# EAGLE schematic Eagle_schematic_v1 (EAGLE 7.5.0)
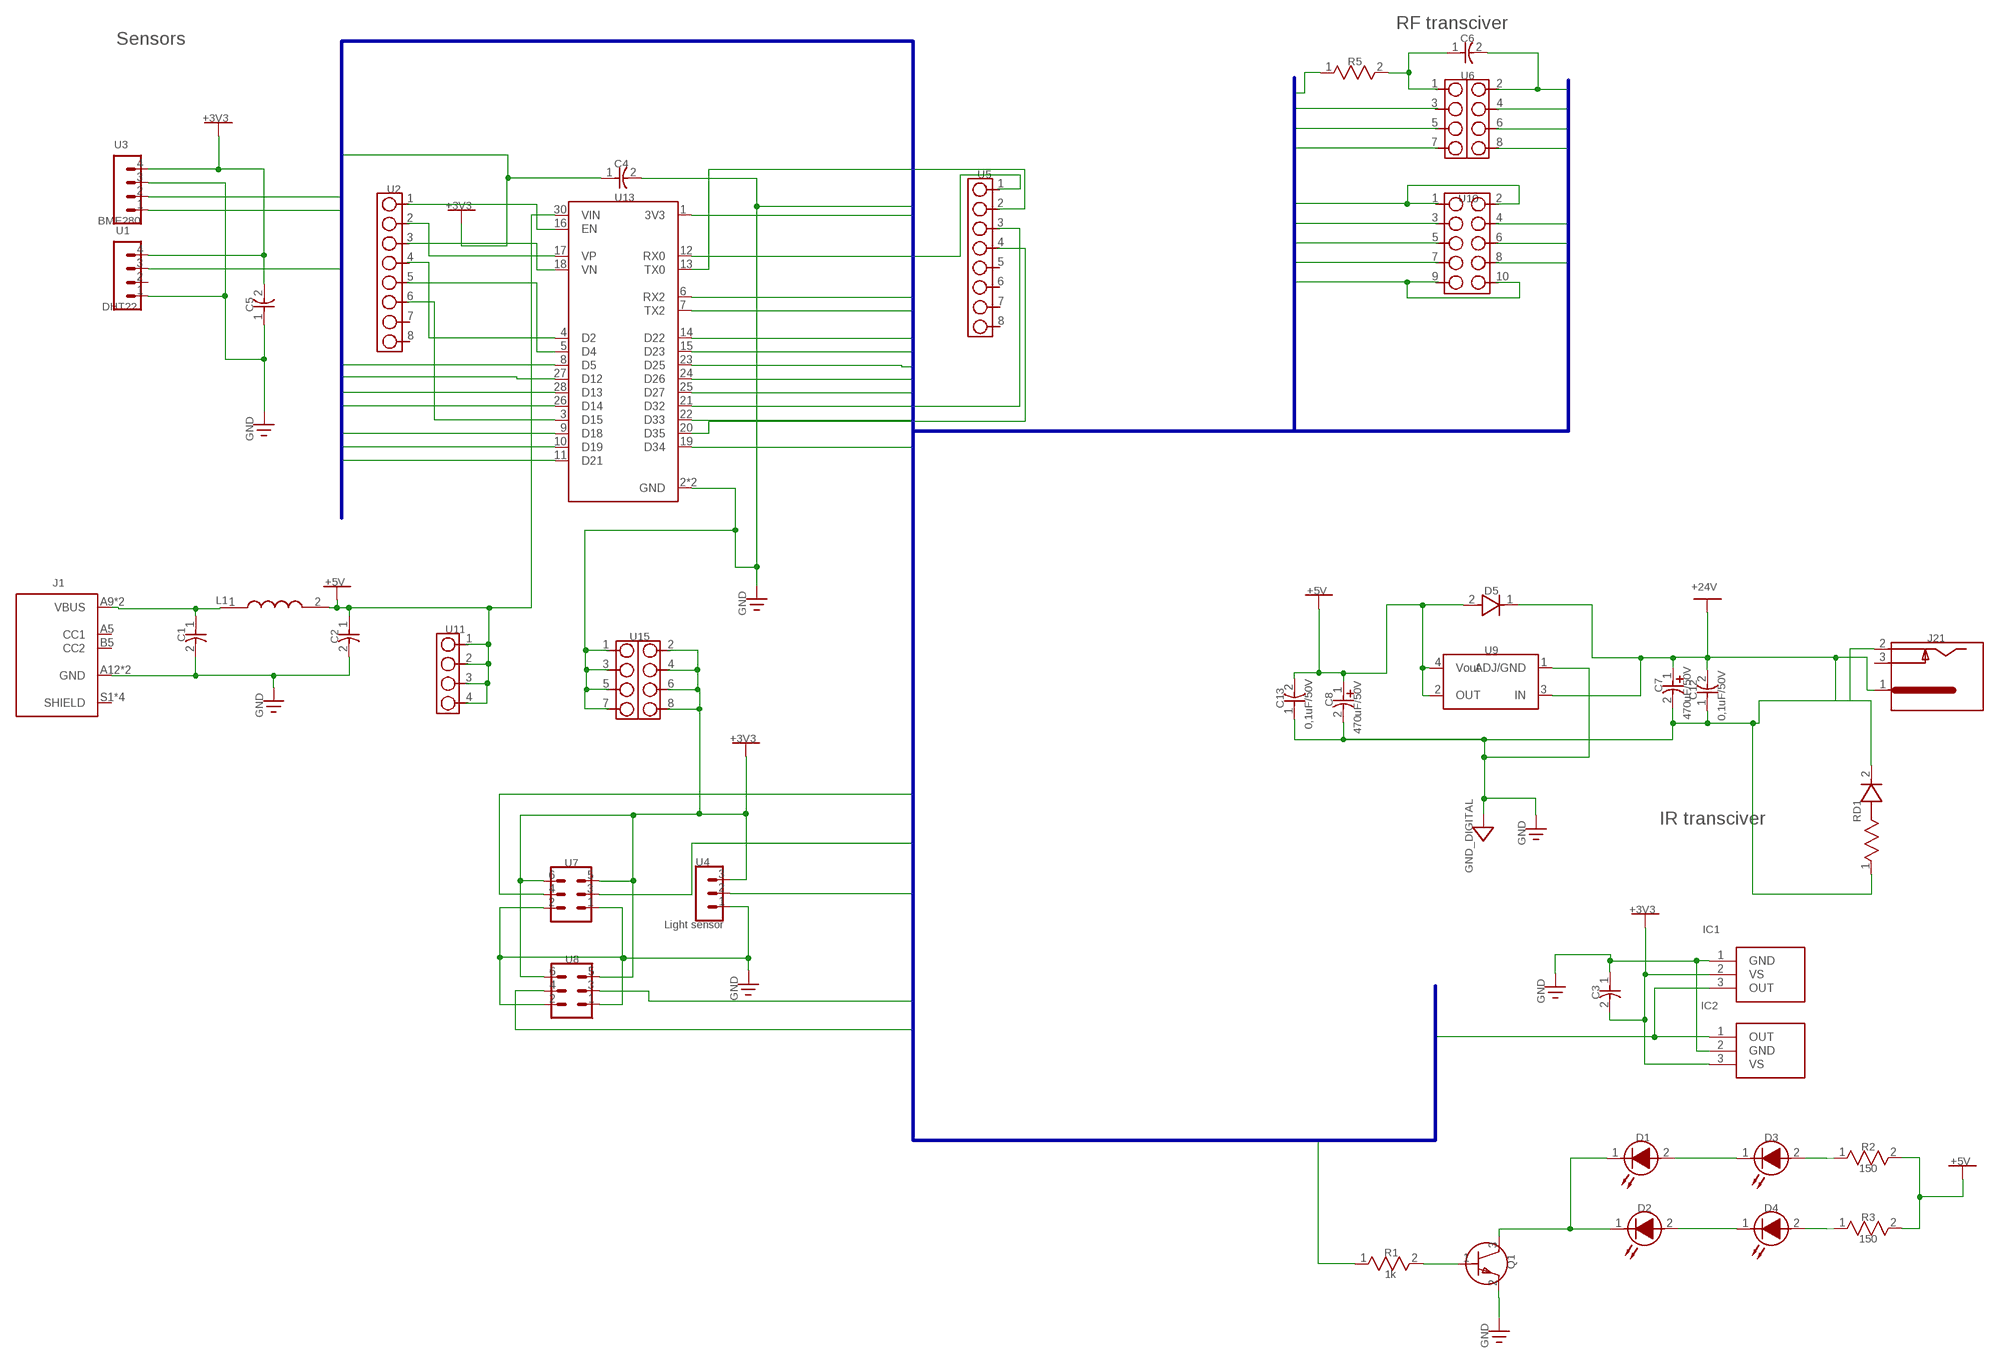
[diagram p0: schematic, sheet 1]

## Parts
C1  CAP_1206  [CAP_1206]
C2  CAP_1206  [CAP_1206]
C3  CAP_1206  [CAP_1206]
C4  CAP_1206  [CAP_1206]
C5  CAP_1206  [CAP_1206]
C6  CAP_1206  [CAP_1206]
C7  470uF/50V  CAP100RP  [CAPPR-2.54/5.08]
C8  470uF/50V  CAP100RP  [CAPPR-2.54/5.08]
C12  0,1uF/50V  CAP_1206  [CAP_1206]
C13  0,1uF/50V  CAP_1206  [CAP_1206]
D1  LED-5MM_ROUND_RED  [LED-5MM_ROUND_RED]
D2  LED-5MM_ROUND_RED  [LED-5MM_ROUND_RED]
D3  LED-5MM_ROUND_RED  [LED-5MM_ROUND_RED]
D4  LED-5MM_ROUND_RED  [LED-5MM_ROUND_RED]
D5  1N4001  [DO-41]
IC1  TSOP31236  [TSOP31236]
IC2  TSOP34838  [TSOP4856]
J1  USB4125-GF-A-0190_REVA2  [GCT_USB4125-GF-A-0190_REVA2]
J21  PJ-017C  [CUI_PJ-017C]
L1  NLFV32T-3R3M-EF  [INDM3225X240N]
Q1  BC848BLT3G  [SOT23-3P95_240X110L43X44N]
R1  1k  RES_0805  [RES_0805]
R2  150  RES_0805  [RES_0805]
R3  150  RES_0805  [RES_0805]
R5  RES_0402  [RES_0402]
RD1  RESISTOR_DIODE_ASSY  [VR37_VERTICAL]
U1  DHT22  MA04-1  [MA04-1]
U2  HDR-1X8  [HDR-1X8]
U3  BME280  MA04-1  [MA04-1]
U4  Light sensor  MA03-1  [MA03-1]
U5  HDR-1X8  [HDR-1X8]
U6  HDR-2X4  [HDR-2X4]
U7  MA03-2  [MA03-2]
U8  MA03-2  [MA03-2]
U9  LT1117CST-5#PBF  [SOT223-4P230_700X180L65X72N]
U10  HDR-2X5  [HDR-2X5]
U11  HDR-1X4  [HDR-1X4]
U13  ESP32-DEVKIT-V1  [MODULE_ESP32_DEVKIT_V1]
U15  HDR-2X4  [HDR-2X4]

## Nets
3v3 [power]: C3.2 C4.1 C5.2 C6.2 IC1.2(VS) IC2.3(VS) U1.4 U3.4 U4.3 U6.2 U7.5 U7.6 U8.5 U8.6 U10.1 U10.2 U13.1(3V3) U15.2 U15.4 U15.6 U15.8 ; supply symbol labelled +3V3
5V [power]: C2.1 C8.1(PLUS) C13.2 D5.2(A) L1.2 R2.2 R3.2 U9.2(OUT) U9.4(Vout) U11.1 U11.2 U11.3 U11.4 U13.30(VIN) ; supply symbol labelled +5V
24V [ground]: C7.1(PLUS) C12.2 D5.1(K) J21.1 RD1.2 U9.3(IN) ; supply symbol labelled +24V
CSN: U6.8 U10.7 U13.8(D5)
DHT11/22: U1.3 U13.6(RX2)
GDO0: U6.7 U10.8 U13.27(D12)
GDO2 [power]: U6.6 U10.6 U13.25(D27)
GND [power]: C1.2 C2.2 C3.1 C4.2 C5.1 C7.2(MINUS) C8.2(MINUS) C12.1 C13.1 IC1.1(GND) IC2.2(GND) J1.A12(GND) J1.B12(GND) J21.2 Q1.2(E) R5.1 RD1.1 U1.1 U3.3 U4.1 U7.1 U7.2 U8.1 U8.2 U9.1(ADJ/GND) U10.9 U10.10 U13.2(GND) U13.29(GND) U15.1 U15.3 U15.5 U15.7 ; supply symbol labelled GND_DIGITAL
io13: U7.3 U13.28(D13)
io17: U7.4 U13.7(TX2)
io25: U8.3 U13.23(D25)
io33: U8.4 U13.22(D33)
ir_reciver_1: IC1.3(OUT) IC2.1(OUT) U13.24(D26)
ir_tr: R1.1 U13.26(D14)
light: U4.2 U13.19(D34)
MISO: U6.5 U10.5 U13.10(D19)
MOSI: U6.3 U10.3 U13.15(D23)
Net_0: D1.2(A) D3.1(K)
Net_1: D2.2(A) D4.1(K)
Net_2: D4.2(A) R3.1
Net_3: D3.2(A) R2.1
Net_6 [power]: C1.1 J1.A9(VBUS) J1.B9(VBUS) L1.1
Net_7: D1.1(K) D2.1(K) Q1.3(C)
Net_8: Q1.1(B) R1.2
Net_27: U2.1 U13.16(EN)
Net_28: U2.2 U13.17(VP)
Net_29: U2.3 U13.18(VN)
Net_30: U2.4 U13.4(D2)
Net_31: U2.5 U13.5(D4)
Net_32: U2.6 U13.3(D15)
Net_33: U5.1 U13.12(RX0)
Net_34: U5.2 U13.13(TX0)
Net_35: U5.3 U13.21(D32)
Net_36: U5.4 U13.20(D35)
Net_37: C6.1 R5.2 U6.1
SCK: U6.4 U10.4 U13.9(D18)
SCL: U3.2 U13.14(D22)
SDA: U3.1 U13.11(D21)
Unconnected: J1.A5(CC1) J1.B5(CC2) J1.S1(SHIELD) J1.S2(SHIELD) J1.S3(SHIELD) J1.S4(SHIELD) U1.2 U2.7 U2.8 U5.5 U5.6 U5.7 U5.8

## Buses
3v3,CSN,DHT11/22,GDO0,GDO2,GND,io13,io17,io25,io33,ir_reciver_1,ir_tr,light,MISO,MOSI,SCK,SCL,SDA

## Notes on the sheet
- RF transciver
- Sensors
- C6
- R5
- U6
- +3V3
- U3
- C4
- U5
- U2
- U13 | U10
- +3V3
- BME280
- U1
- DHT22
- C5
- GND
- J1 | +5V
- +24V
- +5V | D5
- L1
- GND
- U11
- C1 | C2 | U15 | J21
- U9
- C7
- C12
- C13 | C8
- GND | 470uF/50V
- 0,1uF/50V
- 0,1uF/50V
- 470uF/50V
- +3V3
- IR transciver
- RD1
- GND
- U7 | U4
- GND_DIGITAL
- +3V3
- Light sensor
- IC1
- U8
- GND | C3
- GND
- IC2
- D1 | D3
- R2
- 150 | +5V
- D2 | D4
- R3
- 150
- R1
- 1k | Q1
- GND

## Power pins joined to a net without a drawn wire
3: J21.3

## Library data of the parts
C1-C6 C12 C13 = common:CAP_1206; UNIQUE_NAME: CAP_1206
C7 C8 = common:CAP100RP
D1-D4 = common:LED-5MM_ROUND_RED; DATASHEET: http://datasheets.diptrace.com/sensors_led/WP2523SURC.pdf; MANUFACTURER: Kingbright; UNIQUE_NAME: KINGBRIGHT_LED-5R_RED
D5 = common:1N4001
IC1 = common:TSOP31236; DATASHEET: https://componentsearchengine.com/Datasheets/1/TSOP31236.pdf; DESCRIPTION: IR Receiver Module 36kHz; HEIGHT: 12.9 mm; MANUFACTURER: Vishay; MANUFACTURER_NAME: Vishay; MANUFACTURER_PART_NUMBER: TSOP31236; MOUSER_PART_NUMBER: 782-TSOP31236; MOUSER_PRICE/STOCK: https://www.mouser.co.uk/ProductDetail/Vishay-Semiconductors/TSOP31236?qs=MEEM2Ld9hecTgGpJICBAKQ%3D%3D
IC2 = common:TSOP34838; DATASHEET: https://www.vishay.com/docs/82489/tsop322.pdf; DESCRIPTION: IR Receiver Module 38kHz; MANUFACTURER: Vishay; MANUFACTURER_NAME: Vishay; MANUFACTURER_PART_NUMBER: TSOP34838; MOUSER_PART_NUMBER: 782-TSOP34838; MOUSER_PRICE/STOCK: https://www.mouser.co.uk/ProductDetail/Vishay-Semiconductors/TSOP34838?qs=mI1nX2bqwFnDB6kD41OpRA%3D%3D
J1 = common:USB4125-GF-A-0190_REVA2; DESCRIPTION: USB-C (USB TYPE-C) USB 2.0 Receptacle Connector 24 (6+18 Dummy) Position Surface Mount, Right Angle; Through Hole
J21 = common:PJ-017C; DATASHEET: http://datasheets.diptrace.com/con_power/pj-017c.pdf; MANUFACTURER: CUI INC; PART_NUMBER_(DIGI-KEY): CP-017C-ND; UNIQUE_NAME: CUI_PJ-017C
L1 = common:NLFV32T-3R3M-EF; DATASHEET: https://componentsearchengine.com/Datasheets/1/NLFV32T-3R3M-EF.pdf; DESCRIPTION: TDK - NLFV32T-3R3M-EF - High Frequency Inductor, 3.3 H, 420 mA, 1210 [3225 Metric], Shielded, 0.11 ohm; HEIGHT: 2.4 mm; MANUFACTURER: TDK; MANUFACTURER_NAME: TDK; MANUFACTURER_PART_NUMBER: NLFV32T-3R3M-EF; MOUSER_PART_NUMBER: 810-NLFV32T-3R3M-EF; MOUSER_PRICE/STOCK: https://www.mouser.com/Search/Refine.aspx?Keyword=810-NLFV32T-3R3M-EF
Q1 = common:BC848BLT3G; DATASHEET: http://datasheets.diptrace.com/on_semi/bc846alt1-d.pdf; MANUFACTURER: ON Semiconductor; PART_NUMBER_(DIGI-KEY): BC848BLT3GOSDKR-ND; PART_NUMBER_(LCSC): C896678; PART_NUMBER_(MOUSER): 863-BC848BLT3G; UNIQUE_NAME: ONSEMI_318-08
R1 = common:RES_0805; UNIQUE_NAME: RES_0805
R2 R3 = common:RES_0805; UNIQUE_NAME: RES_0805; VALUE: 1k
R5 = common:RES_0402; UNIQUE_NAME: RES_0402
RD1 = common:RESISTOR_DIODE_ASSY; MANUFACTURER: eMotorWerks
U1 = common:MA04-1; VALUE: BME280
U2 U5 = common:HDR-1X8
U3 = common:MA04-1
U4 = common:MA03-1
U6 U15 = common:HDR-2X4
U7 U8 = common:MA03-2
U9 = common:LT1117CST-5#PBF; DATASHEET: http://datasheets.diptrace.com/on_semi/LM317M.pdf; MANUFACTURER: Linear Technology; PART_NUMBER_(DIGI-KEY): LT1117CST-5#PBF-ND; PART_NUMBER_(LCSC): C579650; PART_NUMBER_(MOUSER): 584-LT1117CST-5#PBF; UNIQUE_NAME: LINEAR_05-08-1630
U10 = common:HDR-2X5
U11 = common:HDR-1X4
U13 = common:ESP32-DEVKIT-V1; DESCRIPTION: Dual core, Wi-Fi: 2.4 GHz up to 150 Mbits/s,BLE (Bluetooth Low Energy) and legacy Bluetooth, 32 bits, Up to 240 MHz

## Net classes
1 power: width 0.5 mm, clearance 0.1 mm
2 ground: width 1.524 mm, clearance 0.152 mm